# Altium schematic sheet MB1363_Top.SchDoc: MB1363 Top: hierarchical view
size A4; Date: Not used; ApprovedBy: Not used; CheckedBy: Not used; Author: Not used; CompanyName: STMicroelectronics; DrawnBy: Not used; Engineer: Not used; Organization: Not used; Address1: Not used; Address2: Not used; Address3: Not used; Address4: Not used; DocumentNumber: 2; Revision: Not used; SheetNumber: 2; SheetTotal: 9; CurrentTime: Not used; CurrentDate: Not used; Time: Not used; DocumentFullPathAndName: Not used; DocumentName: Not used; ModifiedDate: Not used; ImagePath: Not used; ProjectName: Not used; Application_BuildNumber: Not used
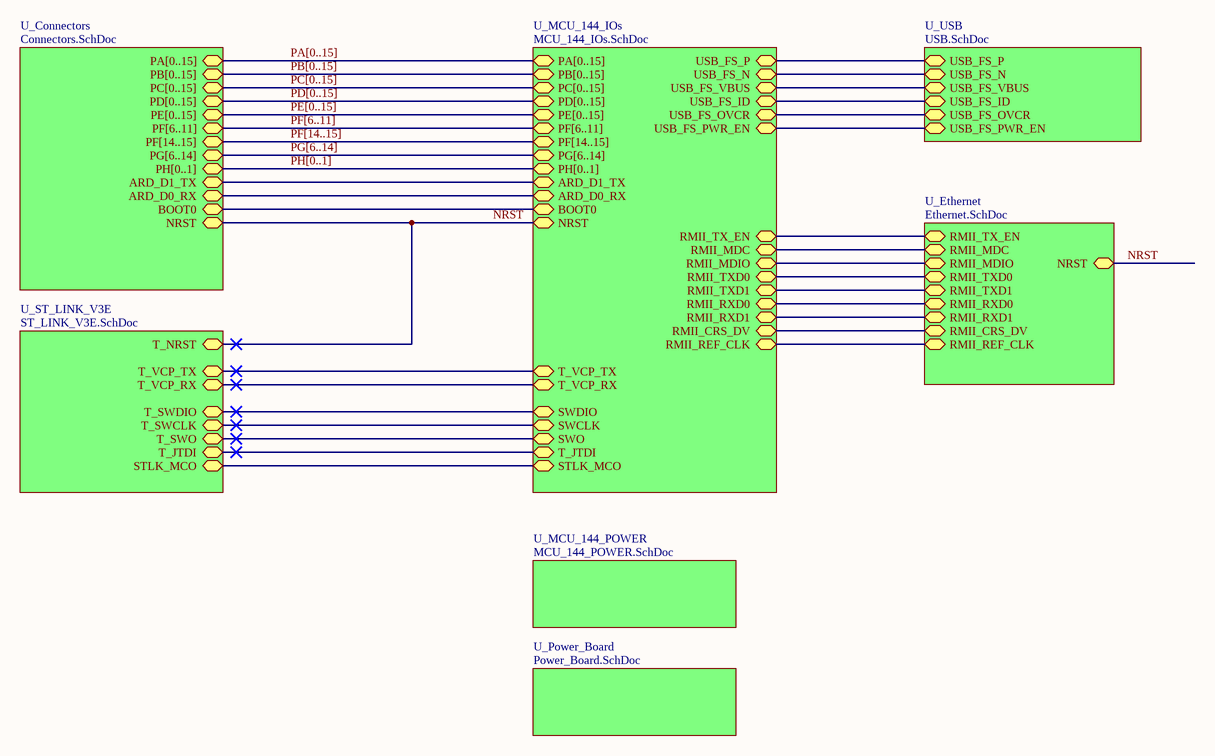
[diagram p0: MB1363_Top.SchDoc]

## Sub-sheets
U_Connectors = Connectors.SchDoc: PA[0..15] (bidir), PB[0..15] (bidir), PC[0..15] (bidir), NRST (bidir), PD[0..15] (bidir), PE[0..15] (bidir), PF[6..11] (bidir), PG[6..14] (bidir), PH[0..1] (bidir), BOOT0 (bidir), PF[14..15] (bidir), ARD_D1_TX (bidir), ARD_D0_RX (bidir)
U_Ethernet = Ethernet.SchDoc: RMII_CRS_DV (bidir), RMII_REF_CLK (bidir), RMII_TXD0 (bidir), RMII_RXD0 (bidir), RMII_TX_EN (bidir), NRST (bidir), RMII_RXD1 (bidir), RMII_MDC (bidir), RMII_TXD1 (bidir), RMII_MDIO (bidir)
U_MCU_144_IOs = MCU_144_IOs.SchDoc: NRST (bidir), BOOT0 (bidir), SWO (bidir), STLK_MCO (bidir), SWCLK (bidir), SWDIO (bidir), RMII_TX_EN (bidir), RMII_MDC (bidir), RMII_TXD0 (bidir), RMII_TXD1 (bidir), RMII_REF_CLK (bidir), RMII_RXD1 (bidir), RMII_MDIO (bidir), RMII_CRS_DV (bidir), RMII_RXD0 (bidir), USB_FS_N (bidir), USB_FS_P (bidir), USB_FS_OVCR (bidir), USB_FS_PWR_EN (bidir), USB_FS_VBUS (bidir), USB_FS_ID (bidir), T_VCP_TX (bidir), T_VCP_RX (bidir), PA[0..15] (bidir), PB[0..15] (bidir), PC[0..15] (bidir), PD[0..15] (bidir), PE[0..15] (bidir), PF[6..11] (bidir), PG[6..14] (bidir), PH[0..1] (bidir), PF[14..15] (bidir), ARD_D1_TX (bidir), ARD_D0_RX (bidir), T_JTDI (bidir)
U_MCU_144_POWER = MCU_144_POWER.SchDoc: no entries
U_Power_Board = Power_Board.SchDoc: no entries
U_ST_LINK_V3E = ST_LINK_V3E.SchDoc: T_NRST (bidir), STLK_MCO (bidir), T_SWDIO (bidir), T_VCP_TX (bidir), T_VCP_RX (bidir), T_SWCLK (bidir), T_SWO (bidir), T_JTDI (bidir)
U_USB = USB.SchDoc: USB_FS_N (bidir), USB_FS_P (bidir), USB_FS_OVCR (bidir), USB_FS_PWR_EN (bidir), USB_FS_VBUS (bidir), USB_FS_ID (bidir)

## Nets
NRST: sheet U_Connectors/NRST, sheet U_MCU_144_IOs/NRST, sheet U_Ethernet/NRST, sheet U_ST_LINK_V3E/T_NRST
(unnamed): sheet U_Connectors/BOOT0, sheet U_MCU_144_IOs/BOOT0
(unnamed): sheet U_Connectors/ARD_D1_TX, sheet U_MCU_144_IOs/ARD_D1_TX
(unnamed): sheet U_Connectors/ARD_D0_RX, sheet U_MCU_144_IOs/ARD_D0_RX
(unnamed): sheet U_MCU_144_IOs/SWO, sheet U_ST_LINK_V3E/T_SWO
(unnamed): sheet U_MCU_144_IOs/STLK_MCO, sheet U_ST_LINK_V3E/STLK_MCO
(unnamed): sheet U_MCU_144_IOs/SWCLK, sheet U_ST_LINK_V3E/T_SWCLK
(unnamed): sheet U_MCU_144_IOs/SWDIO, sheet U_ST_LINK_V3E/T_SWDIO
(unnamed): sheet U_MCU_144_IOs/RMII_TX_EN, sheet U_Ethernet/RMII_TX_EN
(unnamed): sheet U_MCU_144_IOs/RMII_MDC, sheet U_Ethernet/RMII_MDC
(unnamed): sheet U_MCU_144_IOs/RMII_TXD0, sheet U_Ethernet/RMII_TXD0
(unnamed): sheet U_MCU_144_IOs/RMII_TXD1, sheet U_Ethernet/RMII_TXD1
(unnamed): sheet U_MCU_144_IOs/RMII_REF_CLK, sheet U_Ethernet/RMII_REF_CLK
(unnamed): sheet U_MCU_144_IOs/RMII_RXD1, sheet U_Ethernet/RMII_RXD1
(unnamed): sheet U_MCU_144_IOs/RMII_MDIO, sheet U_Ethernet/RMII_MDIO
(unnamed): sheet U_MCU_144_IOs/RMII_CRS_DV, sheet U_Ethernet/RMII_CRS_DV
(unnamed): sheet U_MCU_144_IOs/RMII_RXD0, sheet U_Ethernet/RMII_RXD0
(unnamed): sheet U_MCU_144_IOs/USB_FS_N, sheet U_USB/USB_FS_N
(unnamed): sheet U_MCU_144_IOs/USB_FS_P, sheet U_USB/USB_FS_P
(unnamed): sheet U_MCU_144_IOs/USB_FS_OVCR, sheet U_USB/USB_FS_OVCR
(unnamed): sheet U_MCU_144_IOs/USB_FS_PWR_EN, sheet U_USB/USB_FS_PWR_EN
(unnamed): sheet U_MCU_144_IOs/USB_FS_VBUS, sheet U_USB/USB_FS_VBUS
(unnamed): sheet U_MCU_144_IOs/USB_FS_ID, sheet U_USB/USB_FS_ID
(unnamed): sheet U_MCU_144_IOs/T_VCP_TX, sheet U_ST_LINK_V3E/T_VCP_TX
(unnamed): sheet U_MCU_144_IOs/T_VCP_RX, sheet U_ST_LINK_V3E/T_VCP_RX
(unnamed): sheet U_MCU_144_IOs/T_JTDI, sheet U_ST_LINK_V3E/T_JTDI

## Buses and harness runs
bus PA[0..15] = sheet U_Connectors/PA[0..15] = sheet U_MCU_144_IOs/PA[0..15]
bus PB[0..15] = sheet U_Connectors/PB[0..15] = sheet U_MCU_144_IOs/PB[0..15]
bus PC[0..15] = sheet U_Connectors/PC[0..15] = sheet U_MCU_144_IOs/PC[0..15]
bus PD[0..15] = sheet U_Connectors/PD[0..15] = sheet U_MCU_144_IOs/PD[0..15]
bus PE[0..15] = sheet U_Connectors/PE[0..15] = sheet U_MCU_144_IOs/PE[0..15]
bus PF[6..11] = sheet U_Connectors/PF[6..11] = sheet U_MCU_144_IOs/PF[6..11]
bus PF[14..15] = sheet U_Connectors/PF[14..15] = sheet U_MCU_144_IOs/PF[14..15]
bus PG[6..14] = sheet U_Connectors/PG[6..14] = sheet U_MCU_144_IOs/PG[6..14]
bus PH[0..1] = sheet U_Connectors/PH[0..1] = sheet U_MCU_144_IOs/PH[0..1]

## Notes on the sheet
- Title:
- Project:
- Size:
- Revision:
- Variant:
- A4
- -
- Date:
- Reference:
- Sheet:
- of